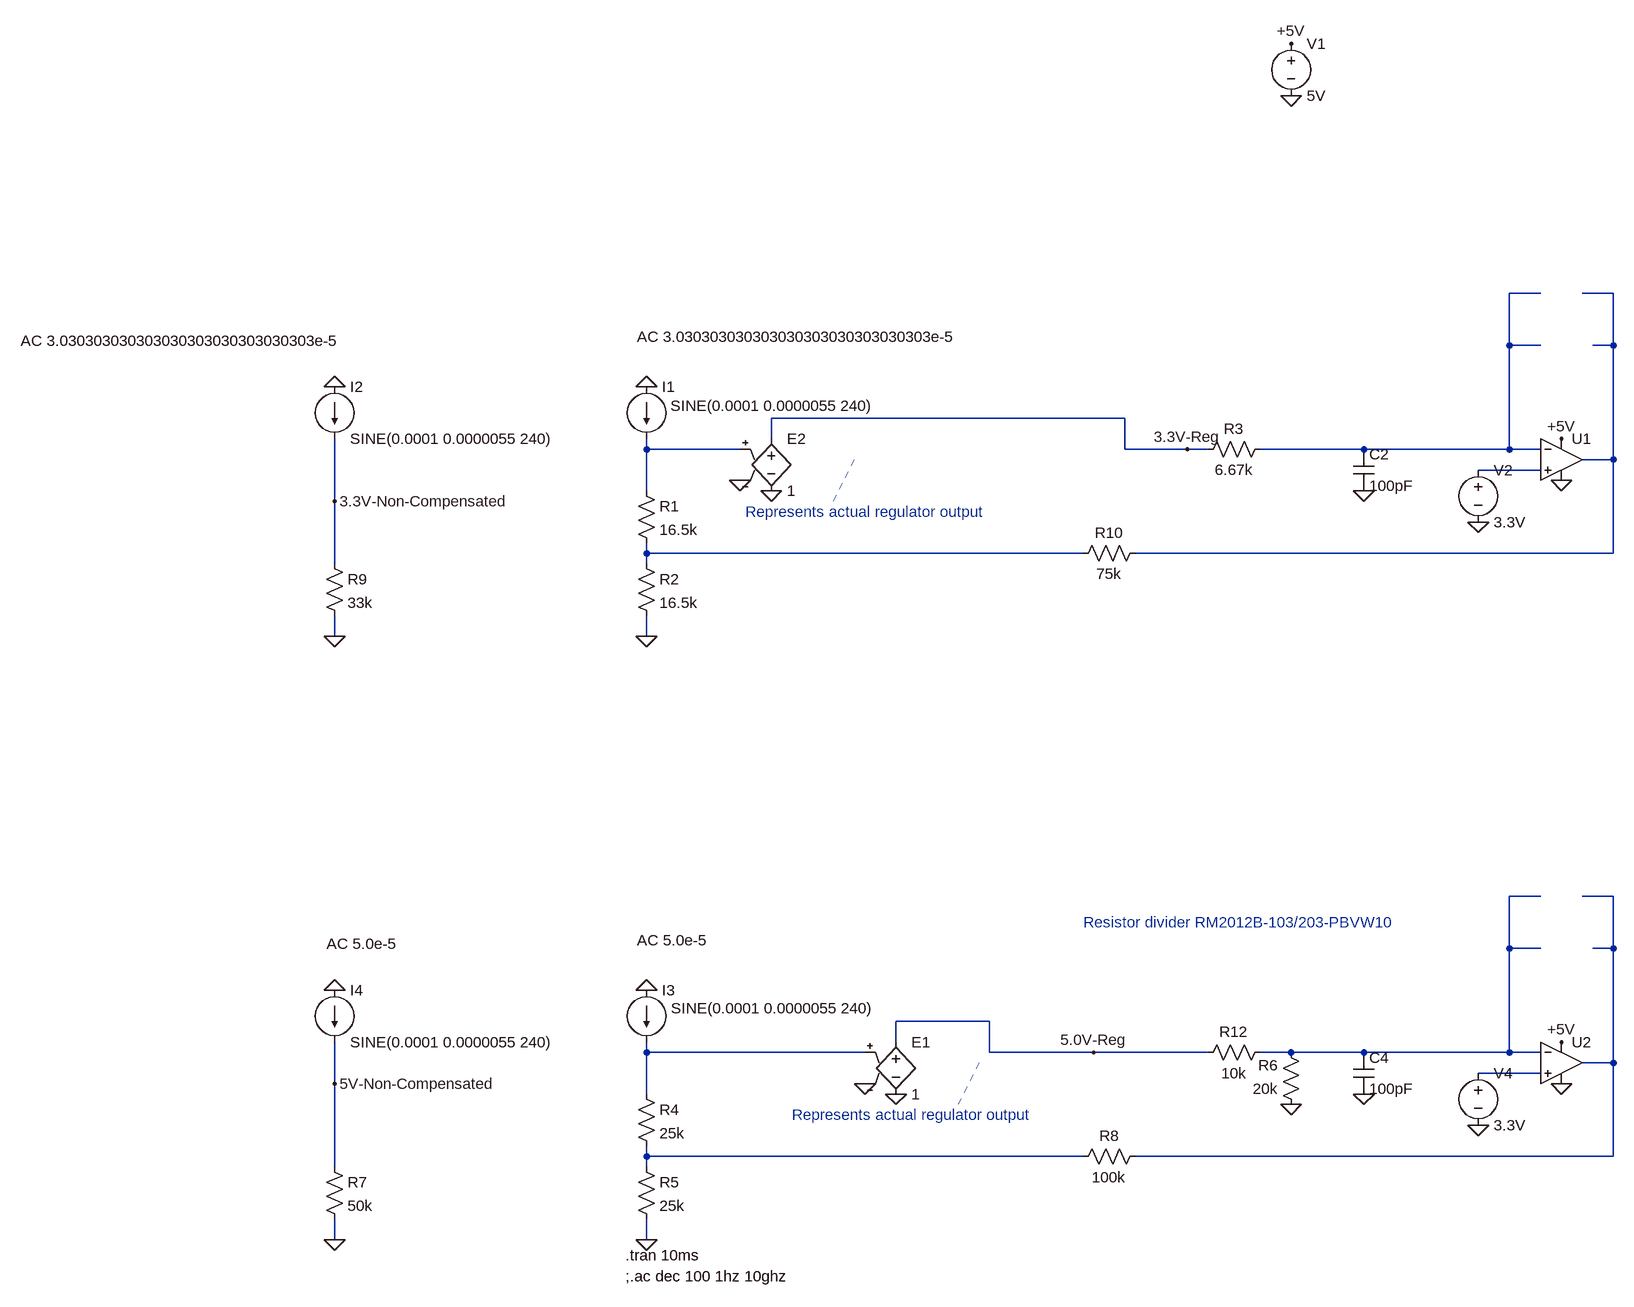
[diagram p0: schematic Trim Temp Variation AC.asc]
Trim Temp Variation AC.asc, the LTspice schematic file:
Version 4
SHEET 1 1348 1432
WIRE 1040 -96 992 -96
WIRE 1152 -96 1104 -96
WIRE 992 -16 992 -96
WIRE 1040 -16 992 -16
WIRE 1152 -16 1152 -96
WIRE 1152 -16 1120 -16
WIRE 400 96 -144 96
WIRE -144 128 -144 96
WIRE -336 144 -336 128
WIRE -192 144 -336 144
WIRE 400 144 400 96
WIRE 496 144 400 144
WIRE 528 144 496 144
WIRE 768 144 608 144
WIRE 992 144 992 -16
WIRE 992 144 768 144
WIRE 1040 144 992 144
WIRE 1152 160 1152 -16
WIRE 1152 160 1104 160
WIRE 1040 176 944 176
WIRE -336 208 -336 144
WIRE -816 224 -816 128
WIRE -336 304 -336 288
WIRE 336 304 -336 304
WIRE 1152 304 1152 160
WIRE 1152 304 416 304
WIRE -816 320 -816 224
WIRE -336 320 -336 304
WIRE -816 432 -816 400
WIRE -336 432 -336 400
WIRE 1040 832 992 832
WIRE 1152 832 1104 832
WIRE 992 912 992 832
WIRE 1040 912 992 912
WIRE 1152 912 1152 832
WIRE 1152 912 1120 912
WIRE 192 1024 48 1024
WIRE 48 1056 48 1024
WIRE -336 1072 -336 1056
WIRE 0 1072 -336 1072
WIRE 192 1072 192 1024
WIRE 352 1072 192 1072
WIRE 528 1072 352 1072
WIRE 656 1072 608 1072
WIRE 768 1072 656 1072
WIRE 992 1072 992 912
WIRE 992 1072 768 1072
WIRE 1040 1072 992 1072
WIRE 1152 1088 1152 912
WIRE 1152 1088 1104 1088
WIRE 1040 1104 944 1104
WIRE -816 1120 -816 1056
WIRE -336 1136 -336 1072
WIRE -336 1232 -336 1216
WIRE 336 1232 -336 1232
WIRE 1152 1232 1152 1088
WIRE 1152 1232 416 1232
WIRE -816 1248 -816 1120
WIRE -336 1248 -336 1232
WIRE -816 1360 -816 1328
WIRE -336 1360 -336 1328
FLAG -336 48 0
FLAG -336 432 0
FLAG 1072 192 0
FLAG 656 -400 0
FLAG 656 -480 +5V
FLAG 1072 128 +5V
FLAG 944 256 0
FLAG -816 48 0
FLAG -816 432 0
FLAG 768 208 0
FLAG -336 976 0
FLAG -336 1360 0
FLAG 1072 1120 0
FLAG 1072 1056 +5V
FLAG 944 1184 0
FLAG -816 976 0
FLAG -816 1360 0
FLAG 768 1136 0
FLAG 656 1152 0
FLAG 496 144 3.3V-Reg
FLAG 352 1072 5.0V-Reg
FLAG -816 1120 5V-Non-Compensated
FLAG 0 1120 0
FLAG 48 1136 0
FLAG -192 192 0
FLAG -144 208 0
FLAG -816 224 3.3V-Non-Compensated
SYMBOL current -336 48 R0
WINDOW 123 -15 -77 Left 2
WINDOW 39 0 0 Left 0
WINDOW 3 37 29 Left 2
SYMATTR Value2 AC 3.030303030303030303030303030303e-5
SYMATTR Value SINE(0.0001 0.0000055 240)
SYMATTR InstName I1
SYMBOL res -352 192 R0
SYMATTR InstName R1
SYMATTR Value 16.5k
SYMBOL res -352 304 R0
SYMATTR InstName R2
SYMATTR Value 16.5k
SYMBOL OpAmps\\UniversalOpAmp 1072 160 R0
SYMATTR InstName U1
SYMBOL voltage 656 -496 R0
SYMATTR InstName V1
SYMATTR Value 5V
SYMBOL voltage 944 160 R0
SYMATTR InstName V2
SYMATTR Value 3.3V
SYMBOL current -816 48 R0
WINDOW 123 -483 -71 Left 2
WINDOW 39 0 0 Left 0
SYMATTR Value2 AC 3.030303030303030303030303030303e-5
SYMATTR InstName I2
SYMATTR Value SINE(0.0001 0.0000055 240)
SYMBOL res -832 304 R0
SYMATTR InstName R9
SYMATTR Value 33k
SYMBOL cap 752 144 R0
SYMATTR InstName C2
SYMATTR Value 100pF
SYMBOL res 624 128 R90
WINDOW 0 0 56 VBottom 2
WINDOW 3 32 56 VTop 2
SYMATTR InstName R3
SYMATTR Value 6.67k
SYMBOL current -336 976 R0
WINDOW 123 -15 -77 Left 2
WINDOW 39 0 0 Left 0
WINDOW 3 38 28 Left 2
SYMATTR Value2 AC 5.0e-5
SYMATTR Value SINE(0.0001 0.0000055 240)
SYMATTR InstName I3
SYMBOL res -352 1120 R0
SYMATTR InstName R4
SYMATTR Value 25k
SYMBOL res -352 1232 R0
SYMATTR InstName R5
SYMATTR Value 25k
SYMBOL OpAmps\\UniversalOpAmp 1072 1088 R0
SYMATTR InstName U2
SYMATTR SpiceLine En=0 Enk=0 In=0 Ink=0 Rin=1000Meg
SYMBOL voltage 944 1088 R0
SYMATTR InstName V4
SYMATTR Value 3.3V
SYMBOL current -816 976 R0
WINDOW 123 -12 -71 Left 2
WINDOW 39 0 0 Left 0
SYMATTR Value2 AC 5.0e-5
SYMATTR InstName I4
SYMATTR Value SINE(0.0001 0.0000055 240)
SYMBOL res -832 1232 R0
SYMATTR InstName R7
SYMATTR Value 50k
SYMBOL cap 752 1072 R0
SYMATTR InstName C4
SYMATTR Value 100pF
SYMBOL res 624 1056 R90
WINDOW 0 0 56 VBottom 2
WINDOW 3 32 56 VTop 2
SYMATTR InstName R12
SYMATTR Value 10k
SYMBOL res 672 1168 R180
WINDOW 0 36 76 Left 2
WINDOW 3 36 40 Left 2
SYMATTR InstName R6
SYMATTR Value 20k
SYMBOL e 48 1040 R0
SYMATTR InstName E1
SYMATTR Value 1
SYMBOL res 432 1216 R90
WINDOW 0 0 56 VBottom 2
WINDOW 3 32 56 VTop 2
SYMATTR InstName R8
SYMATTR Value 100k
SYMBOL e -144 112 R0
SYMATTR InstName E2
SYMATTR Value 1
SYMBOL res 432 288 R90
WINDOW 0 0 56 VBottom 2
WINDOW 3 32 56 VTop 2
SYMATTR InstName R10
SYMATTR Value 75k
TEXT -368 1384 Left 2 !.tran 10ms
TEXT -368 1416 Left 2 !;.ac dec 100 1hz 10ghz
TEXT 336 872 Left 2 ;Resistor divider RM2012B-103/203-PBVW10
TEXT -112 1168 Left 2 ;Represents actual regulator output
TEXT -184 240 Left 2 ;Represents actual regulator output
LINE Normal 144 1152 176 1088 2
LINE Normal -48 224 -16 160 2

The netlist it stands for:
* Trim Temp Variation AC.asc
I1 0 N003 SINE(0.0001 0.0000055 240) AC 3.030303030303030303030303030303e-5
R1 N003 N005 16.5k
R2 N005 0 16.5k
XU1 N004 N001 +5V 0 N002 level1 Avol=1Meg GBW=10Meg Vos=0 En=0 Enk=0 In=0 Ink=0 Rin=500Meg  ; pins In+ In- V+ V- OUT
V1 +5V 0 5V
V2 N004 0 3.3V
I2 0 3.3V-Non-Compensated SINE(0.0001 0.0000055 240) AC 3.030303030303030303030303030303e-5
R9 3.3V-Non-Compensated 0 33k
C2 N001 0 100pF
R3 N001 3.3V-Reg 6.67k
I3 0 N008 SINE(0.0001 0.0000055 240) AC 5.0e-5
R4 N008 N010 25k
R5 N010 0 25k
XU2 N009 N006 +5V 0 N007 level1 Avol=1Meg GBW=10Meg Vos=0 En=0 Enk=0 In=0 Ink=0 Rin=1000Meg  ; pins In+ In- V+ V- OUT
V4 N009 0 3.3V
I4 0 5V-Non-Compensated SINE(0.0001 0.0000055 240) AC 5.0e-5
R7 5V-Non-Compensated 0 50k
C4 N006 0 100pF
R12 N006 5.0V-Reg 10k
R6 0 N006 20k
E1 5.0V-Reg 0 N008 0 1
R8 N007 N010 100k
E2 3.3V-Reg 0 N003 0 1
R10 N002 N005 75k
.tran 10ms
;.ac dec 100 1hz 10ghz
* Resistor divider RM2012B-103/203-PBVW10
* Represents actual regulator output
* Represents actual regulator output
.lib UniversalOpAmp1.lib
.backanno
.end